# Altium project Top_Front.PrjPcb
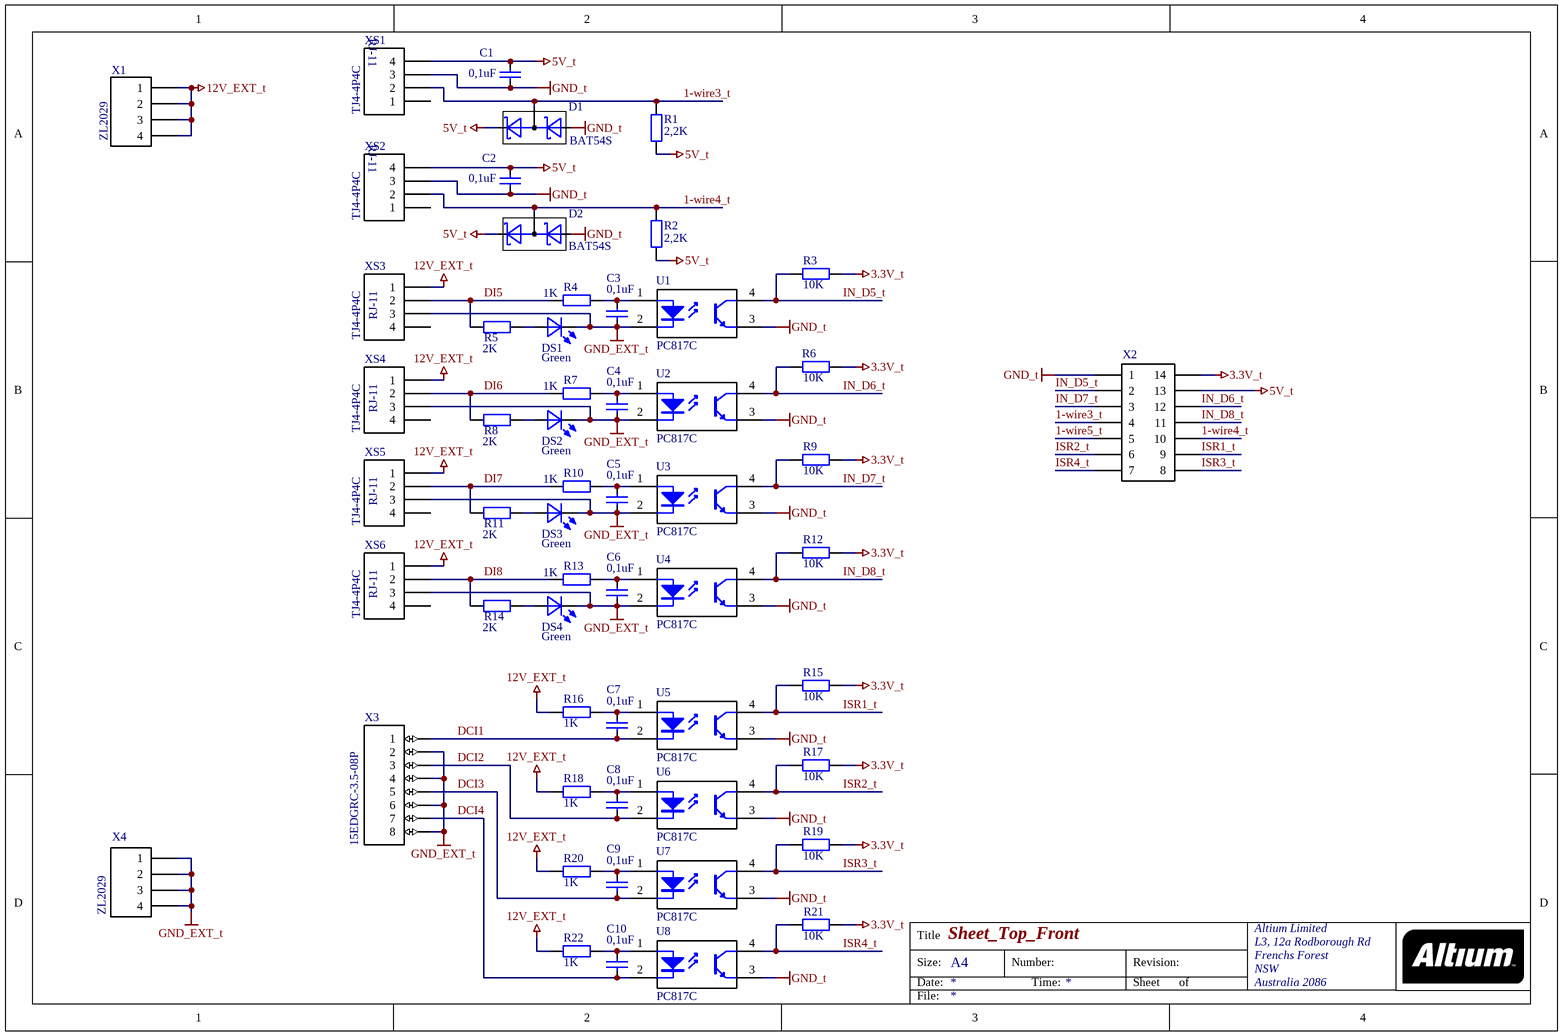
[diagram p0: Sheet_Top_Front.SchDoc]
1 sheet, 56 parts. Net scope: global (net labels, ports and power ports of the same name join across sheets).
Board file: PCB_monitoring_Top_Front.PcbDoc

## Sheet Sheet_Top_Front.SchDoc: Sheet_Top_Front
size A4; Organization: Altium Limited; Address1: L3, 12a Rodborough Rd; Address2: Frenchs Forest; Address3: NSW; Address4: Australia 2086

### Parts
C1  value 0,1uF  [C_0805]  (hidden comment: Cap_Semi)
C2  value 0,1uF  [C_0805]  (hidden comment: Cap_Semi)
C3  value 0,1uF  [C_0805]  (hidden comment: Cap_Semi)
C4  value 0,1uF  [C_0805]  (hidden comment: Cap_Semi)
C5  value 0,1uF  [C_0805]  (hidden comment: Cap_Semi)
C6  value 0,1uF  [C_0805]  (hidden comment: Cap_Semi)
C7  value 0,1uF  [C_0805]  (hidden comment: Cap_Semi)
C8  value 0,1uF  [C_0805]  (hidden comment: Cap_Semi)
C9  value 0,1uF  [C_0805]  (hidden comment: Cap_Semi)
C10  value 0,1uF  [C_0805]  (hidden comment: Cap_Semi)
D1  BAT54S  [SOT-23_d]
D2  BAT54S  [SOT-23_d]
DS1  Green  [LED_SMD_0805]
DS2  Green  [LED_SMD_0805]
DS3  Green  [LED_SMD_0805]
DS4  Green  [LED_SMD_0805]
R1  value 2,2K  [R_0805]  (hidden comment: Resistor)
R2  value 2,2K  [R_0805]  (hidden comment: Resistor)
R3  value 10K  [R_0805]  (hidden comment: Resistor)
R4  value 1K  [R_0805]  (hidden comment: Resistor)
R5  value 2K  [R_0805]  (hidden comment: Resistor)
R6  value 10K  [R_0805]  (hidden comment: Resistor)
R7  value 1K  [R_0805]  (hidden comment: Resistor)
R8  value 2K  [R_0805]  (hidden comment: Resistor)
R9  value 10K  [R_0805]  (hidden comment: Resistor)
R10  value 1K  [R_0805]  (hidden comment: Resistor)
R11  value 2K  [R_0805]  (hidden comment: Resistor)
R12  value 10K  [R_0805]  (hidden comment: Resistor)
R13  value 1K  [R_0805]  (hidden comment: Resistor)
R14  value 2K  [R_0805]  (hidden comment: Resistor)
R15  value 10K  [R_0805]  (hidden comment: Resistor)
R16  value 1K  [R_0805]  (hidden comment: Resistor)
R17  value 10K  [R_0805]  (hidden comment: Resistor)
R18  value 1K  [R_0805]  (hidden comment: Resistor)
R19  value 10K  [R_0805]  (hidden comment: Resistor)
R20  value 1K  [R_0805]  (hidden comment: Resistor)
R21  value 10K  [R_0805]  (hidden comment: Resistor)
R22  value 1K  [R_0805]  (hidden comment: Resistor)
U1  PC817C  [DIP-4]
U2  PC817C  [DIP-4]
U3  PC817C  [DIP-4]
U4  PC817C  [DIP-4]
U5  PC817C  [DIP-4]
U6  PC817C  [DIP-4]
U7  PC817C  [DIP-4]
U8  PC817C  [DIP-4]
X1  ZL2029  [PLS-4-3D]
X2  PLS2-14  [PLS2-14]  (value not drawn)
X3  15EDGRC-3.5-08P  [MC_3.5_8]
X4  PLS-4  [PLS-4-3D]  (value not drawn)
XS1  RJ-11  [RJ-11 - TJ4-4P4C]  (value not drawn)
XS2  RJ-11  [RJ-11 - TJ4-4P4C]  (value not drawn)
XS3  RJ-11  [RJ-11 - TJ4-4P4C]  (value not drawn)
XS4  RJ-11  [RJ-11 - TJ4-4P4C]  (value not drawn)
XS5  RJ-11  [RJ-11 - TJ4-4P4C]  (value not drawn)
XS6  RJ-11  [RJ-11 - TJ4-4P4C]  (value not drawn)

### Nets
3.3V_t: R3.1 R6.1 R9.1 R12.1 R15.1 R17.1 R19.1 R21.1 X2.14
5V_t: C1.1 C2.1 D1.2(C) D2.2(C) R1.2 R2.2 X2.13 XS1.4 XS2.4
12V_EXT_t: R16.2 R18.2 R20.2 R22.2 X1.1 X1.2 X1.3 X1.4 XS3.1 XS4.1 XS5.1 XS6.1
GND_EXT_t: C3.2 C4.2 C5.2 C6.2 DS1.2(C) DS2.2(C) DS3.2(C) DS4.2(C) U1.2(K) U2.2(K) U3.2(K) U4.2(K) X3.2 X3.4 X3.6 X3.8 X4.1 X4.2 X4.3 X4.4 XS3.3 XS4.3 XS5.3 XS6.3
GND_t: C1.2 C2.2 D1.1(A) D2.1(A) U1.3(E) U2.3(E) U3.3(E) U4.3(E) U5.3(E) U6.3(E) U7.3(E) U8.3(E) X2.1 XS1.3 XS2.3
1-wire3_t: D1.3(CA) R1.1 X2.4 XS1.2
1-wire4_t: D2.3(CA) R2.1 X2.10 XS2.2
1-wire5_t: X2.5
DCI1: C7.2 U5.2(K) X3.1
DCI2: C8.2 U6.2(K) X3.3
DCI3: C9.2 U7.2(K) X3.5
DCI4: C10.2 U8.2(K) X3.7
DI5: R4.2 R5.2 XS3.2
DI6: R7.2 R8.2 XS4.2
DI7: R10.2 R11.2 XS5.2
DI8: R13.2 R14.2 XS6.2
IN_D5_t: R3.2 U1.4(C) X2.2
IN_D6_t: R6.2 U2.4(C) X2.12
IN_D7_t: R9.2 U3.4(C) X2.3
IN_D8_t: R12.2 U4.4(C) X2.11
ISR1_t: R15.2 U5.4(C) X2.9
ISR2_t: R17.2 U6.4(C) X2.6
ISR3_t: R19.2 U7.4(C) X2.8
ISR4_t: R21.2 U8.4(C) X2.7
NetC3_1: C3.1 R4.1 U1.1(A)
NetC4_1: C4.1 R7.1 U2.1(A)
NetC5_1: C5.1 R10.1 U3.1(A)
NetC6_1: C6.1 R13.1 U4.1(A)
NetC7_1: C7.1 R16.1 U5.1(A)
NetC8_1: C8.1 R18.1 U6.1(A)
NetC9_1: C9.1 R20.1 U7.1(A)
NetC10_1: C10.1 R22.1 U8.1(A)
NetDS1_1: DS1.1(A) R5.1
NetDS2_1: DS2.1(A) R8.1
NetDS3_1: DS3.1(A) R11.1
NetDS4_1: DS4.1(A) R14.1

Not connected (* = marked no-connect by the designer): XS1 1; XS2 1; XS3 4; XS4 4; XS5 4; XS6 4

### Notes on the sheet
- Title
- Size:
- Date:
- A4
- Number:
- Time:
- Revision:
- Sheet
- of
- File:

### Library data of the parts
C1-C10 = Cap_Semi: Capacitor semi
D1 D2 = BAT54S: Diode Schottky
DS1-DS4 = LED: LED_SMD
U1-U8 = PC817: Optocoupler
X1 = PLS-4: Header, 4-Pin; LatestRevisionDate: 17-Jul-2002; LatestRevisionNote: Re-released for DXP Platform.; Publisher: Altium Limited
X2 = PLS2-14: Header, 14-Pin
X3 = MC_3.5_8: Connector 3.5mm
X4 = PLS-4: ZL2029; LatestRevisionDate: 17-Jul-2002; LatestRevisionNote: Re-released for DXP Platform.; Publisher: Altium Limited
XS1-XS6 = RJ-11: TJ4-4P4C